# Altium schematic sheet GCM_SCH_ESP.SchDoc
size C; SheetNumber: 1; SheetTotal: 1
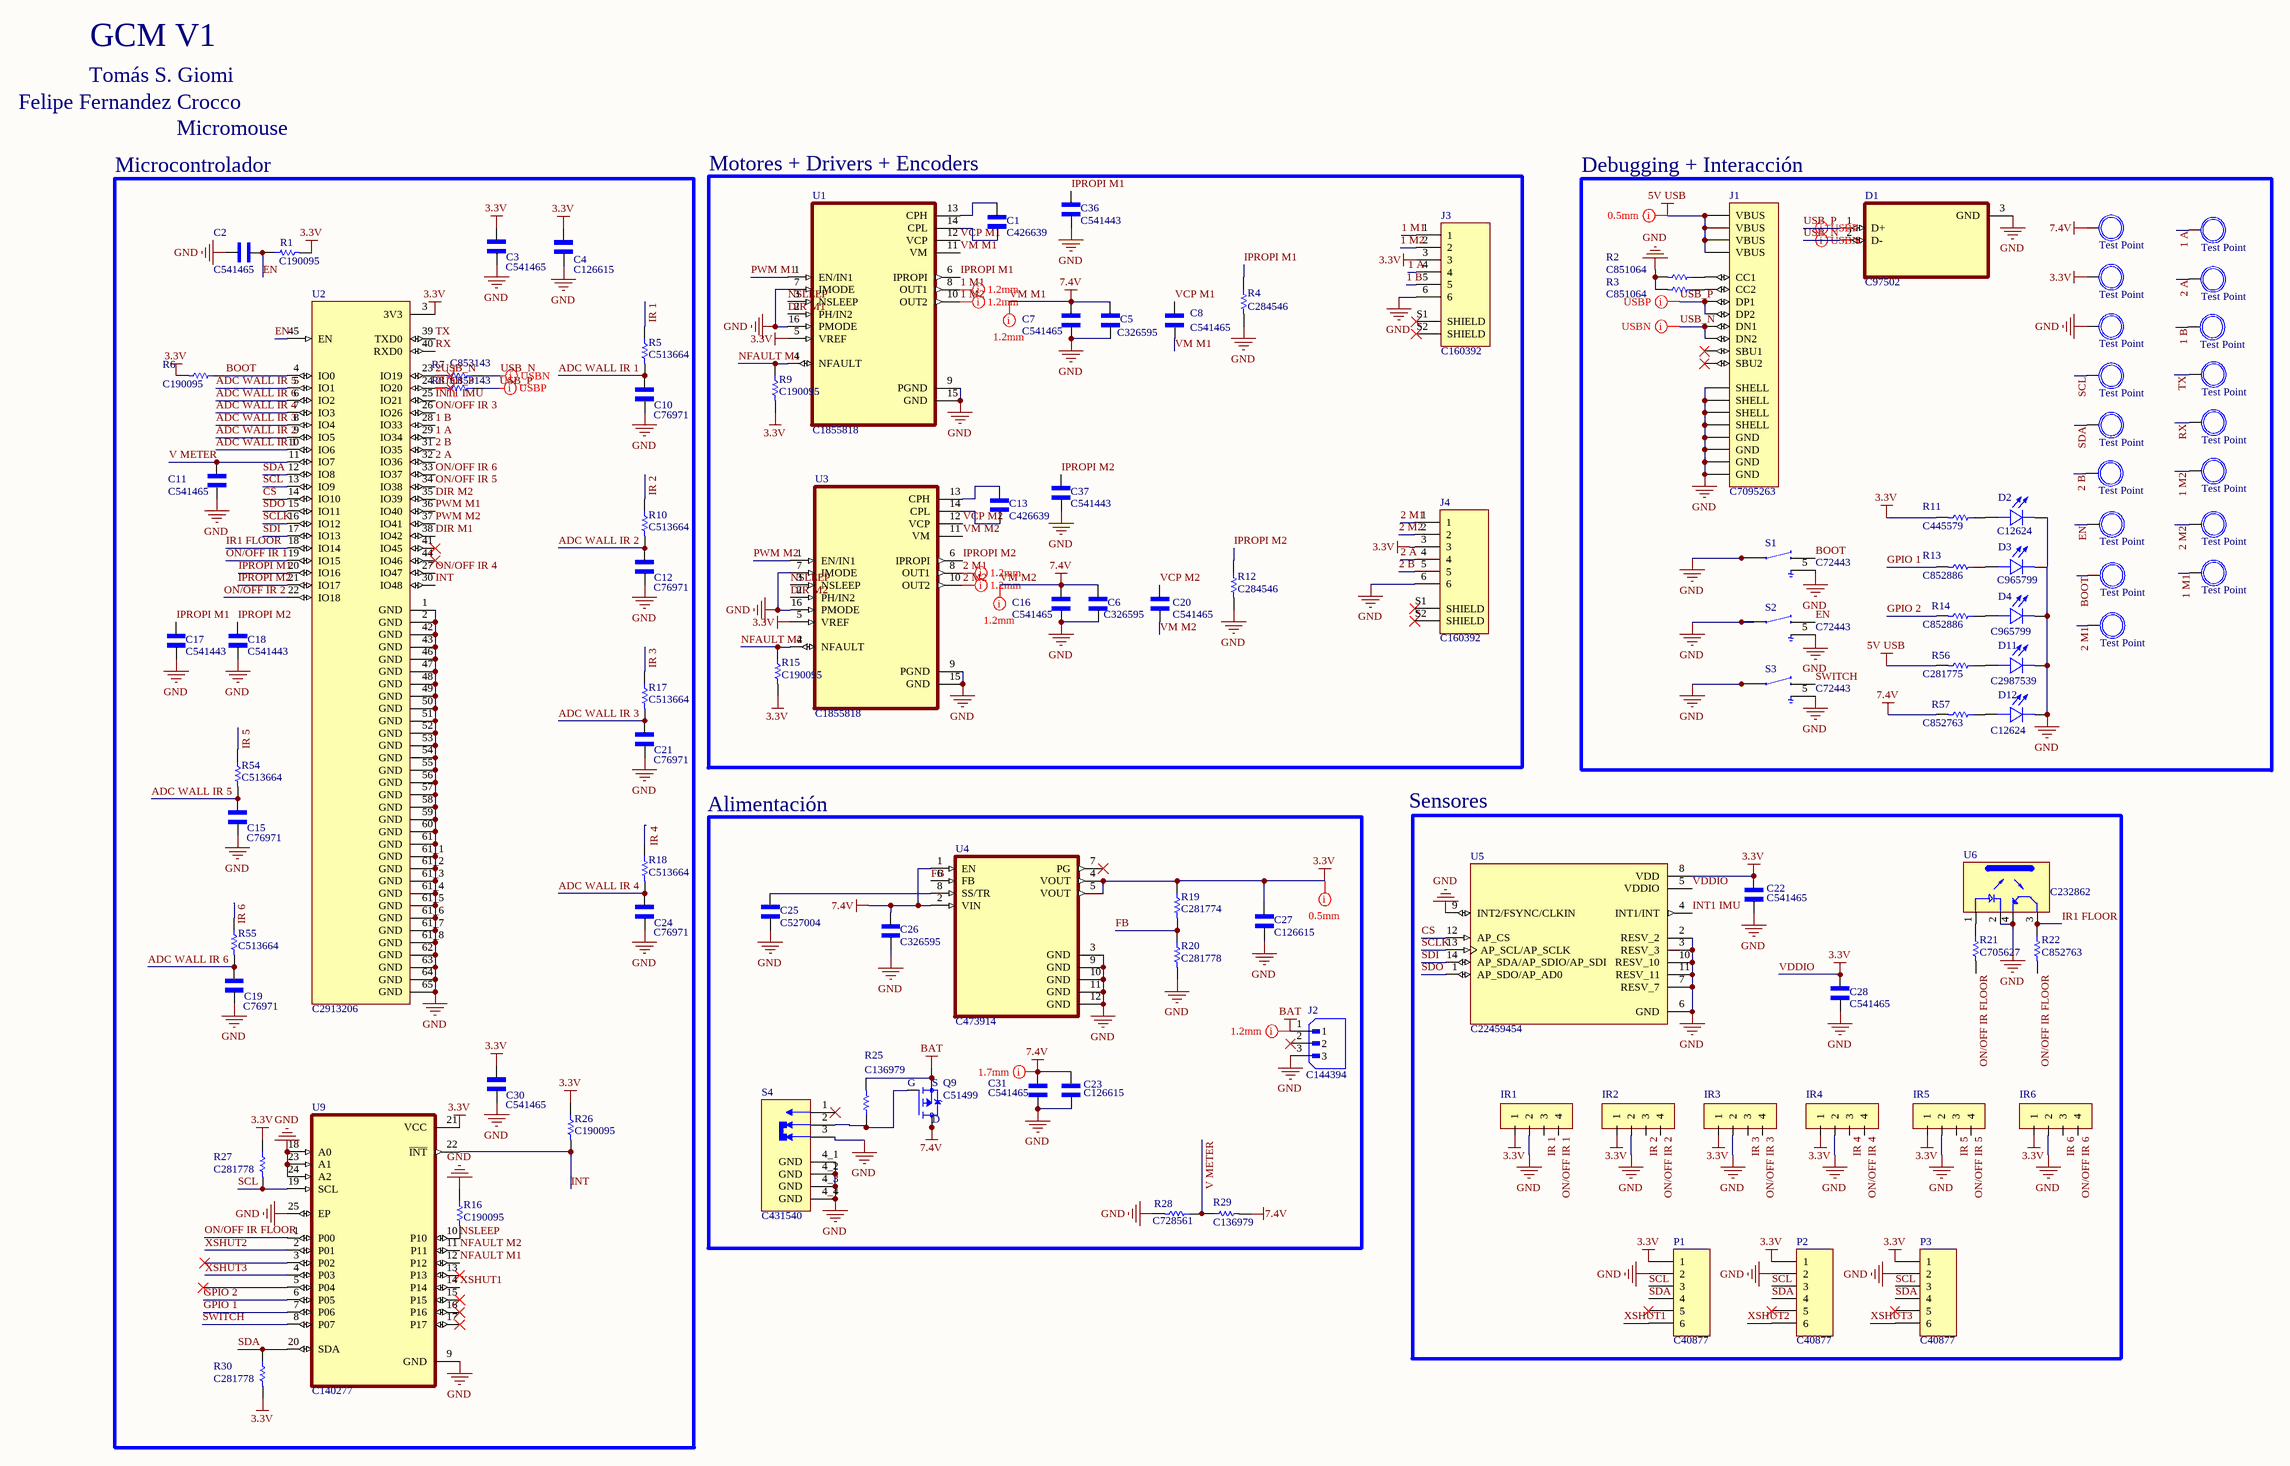
[diagram p0: GCM_SCH_ESP.SchDoc]

## Parts
(Parts that share a designator on the sheet are numbered #1, #2 ... from top to bottom, then left to right.)
?#1  Test Point  [TestPoint]  (no BOM)
?#2  Test Point  [TestPoint]  (no BOM)
?#3  Test Point  [TestPoint]  (no BOM)
?#4  Test Point  [TestPoint]  (no BOM)
?#5  Test Point  [TestPoint]  (no BOM)
?#6  Test Point  [TestPoint]  (no BOM)
?#7  Test Point  [TestPoint]  (no BOM)
?#8  Test Point  [TestPoint]  (no BOM)
?#9  Test Point  [TestPoint]  (no BOM)
?#10  Test Point  [TestPoint]  (no BOM)
?#11  Test Point  [TestPoint]  (no BOM)
?#12  Test Point  [TestPoint]  (no BOM)
?#13  Test Point  [TestPoint]  (no BOM)
?#14  Test Point  [TestPoint]  (no BOM)
?#15  Test Point  [TestPoint]  (no BOM)
?#16  Test Point  [TestPoint]  (no BOM)
?#17  Test Point  [TestPoint]  (no BOM)
C1  C426639  [CAPC1005X55N]
C2  C541465  [CAPC1005X55N]
C3  C541465  [CAPC1005X55N]
C4  C126615  [CAP_CC1210_YAG]
C5  C326595  [CAP_CC0805_YAG]
C6  C326595  [CAP_CC0805_YAG]
C7  C541465  [CAPC1005X55N]
C8  C541465  [CAPC1005X55N]
C10  C76971  [CAPC1005X55N]
C11  C541465  [CAPC1005X55N]
C12  C76971  [CAPC1005X55N]
C13  C426639  [CAPC1005X55N]
C15  C76971  [CAPC1005X55N]
C16  C541465  [CAPC1005X55N]
C17  C541443  [CAPC1005X55N]
C18  C541443  [CAPC1005X55N]
C19  C76971  [CAPC1005X55N]
C20  C541465  [CAPC1005X55N]
C21  C76971  [CAPC1005X55N]
C22  C541465  [CAPC1005X55N]
C23  C126615  [CAP_CC1210_YAG]
C24  C76971  [CAPC1005X55N]
C25  C527004  [CAPC1005X55N]
C26  C326595  [CAP_CC0805_YAG]
C27  C126615  [CAP_CC1210_YAG]
C28  C541465  [CAPC1005X55N]
C30  C541465  [CAPC1005X55N]
C31  C541465  [CAPC1005X55N]
C36  C541443  [CAPC1005X55N]
C37  C541443  [CAPC1005X55N]
D1  C97502  [SOTFL35P100X50-3N]
D2  C12624  [LED_SM0603UYC]
D3  C965799  [LED_SM0603UYC]
D4  C965799  [LED_SM0603UYC]
D11  C2987539  [LED_SM0603UYC]
D12  C12624  [LED_SM0603UYC]
IR1  IR PCB  [IR Board pins]  (value not drawn)
IR2  IR PCB  [IR Board pins]  (value not drawn)
IR3  IR PCB  [IR Board pins]  (value not drawn)
IR4  IR PCB  [IR Board pins]  (value not drawn)
IR5  IR PCB  [IR Board pins]  (value not drawn)
IR6  IR PCB  [IR Board pins]  (value not drawn)
J1  C7095263  [GCT_USB4085-GF-A_REVA4]
J2  C144394  [JST_B3B-XH-A]
J3  C160392  [JST-SH6]
J4  C160392  [JST-SH6]
P1  C40877  [FHDR1X6]
P2  C40877  [FHDR1X6]
P3  C40877  [FHDR1X6]
Q9  C51499  [SOIC127P600X175-8N]
R1  C190095  [RESC1005X35N]
R2  C851064  [RESC1005X35N]
R3  C851064  [RESC1005X35N]
R4  C284546  [RESC1005X35N]
R5  C513664  [RESC1005X35N]
R6  C190095  [RESC1005X35N]
R7  C853143  [RESC1005X35N]
R8  C853143  [RESC1005X35N]
R9  C190095  [RESC1005X35N]
R10  C513664  [RESC1005X35N]
R11  C445579  [RESC1005X35N]
R12  C284546  [RESC1005X35N]
R13  C852886  [RESC1005X35N]
R14  C852886  [RESC1005X35N]
R15  C190095  [RESC1005X35N]
R16  C190095  [RESC1005X35N]
R17  C513664  [RESC1005X35N]
R18  C513664  [RESC1005X35N]
R19  C281774  [RESC1005X35N]
R20  C281778  [RESC1005X35N]
R21  C705627  [RESC1005X35N]
R22  C852763  [RESC1005X35N]
R25  C136979  [RESC1005X35N]
R26  C190095  [RESC1005X35N]
R27  C281778  [RESC1005X35N]
R28  C728561  [RESC1005X35N]
R29  C136979  [RESC1005X35N]
R30  C281778  [RESC1005X35N]
R54  C513664  [RESC1005X35N]
R55  C513664  [RESC1005X35N]
R56  C281775  [RESC1005X35N]
R57  C852763  [RESC1005X35N]
S1  C72443  [SW_KMR221GLFS]
S2  C72443  [SW_KMR221GLFS]
S3  C72443  [SW_KMR221GLFS]
S4  C431540  [SW_MSK12C02]
U1  C1855818  [SOP65P640X120-17N]
U2  C2913206  [XCVR_ESP32-S3-MINI-1-N8]
U3  C1855818  [SOP65P640X120-17N]
U4  C473914  [CONV_TPS82140SILR]
U5  C22459454  [PQFN50P300X250X97-14N]
U6  C232862  [SOIC180P460X187-4N]
U9  C140277  [QFN50P400X400X80-25N]

## Blocks framed on the sheet
Microcontrolador: C2-C4 C10-C12 C15 C17-C19 C21 C24 C30 R1 R5-R8 R10 R16-R18 R26 R27 R30 R54 R55 U2 U9
Motores + Drivers + Encoders: C1 C5-C8 C13 C16 C20 C36 C37 J3 J4 R4 R9 R12 R15 U1 U3
Debugging + Interacción: ?#1-?#17 D1-D4 D11 D12 J1 R2 R3 R11 R13 R14 R56 R57 S1-S3
Alimentación: C23 C25-C27 C31 J2 Q9 R19 R20 R25 R28 R29 S4 U4

## Nets
5V USB: J1.A4(VBUS) J1.A9(VBUS) J1.B4(VBUS) J1.B9(VBUS) R56.2
BAT: J2.1 Q9.1(S) Q9.2(S) Q9.3(S) R25.2
GND: ?#5.1 C2.1 C3.2 C4.1 C5.1 C6.1 C7.2 C10.2 C11.2 C12.2 C15.2 C16.2 C17.2 C18.2 C19.2 C21.2 C22.2 C23.1 C24.2 C25.2 C26.1 C27.1 C28.2 C30.2 C31.2 C36.2 C37.2 D1.3(GND) D2.C D3.C D4.C D11.C D12.C IR1.2 IR2.2 IR3.2 IR4.2 IR5.2 IR6.2 J1.A1(GND) J1.A12(GND) J1.B1(GND) J1.B12(GND) J1.S1(SHELL) J1.S2(SHELL) J1.S3(SHELL) J1.S4(SHELL) J2.3 J3.6 J4.6 P1.2 P2.2 P3.2 R2.2 R3.2 R4.2 R12.2 R16.1 R20.2 R28.2 S1.1 S1.4 S1.5 S2.1 S2.4 S2.5 S3.1 S3.4 S3.5 S4.3 S4.4_1(GND) S4.4_2(GND) S4.4_3(GND) S4.4_4(GND) U1.7(IMODE) U1.9(PGND) U1.15(GND) U1.16(PMODE) U2.1(GND) U2.2(GND) U2.42(GND) U2.43(GND) U2.46(GND) U2.47(GND) U2.48(GND) U2.49(GND) U2.50(GND) U2.51(GND) U2.52(GND) U2.53(GND) U2.54(GND) U2.55(GND) U2.56(GND) U2.57(GND) U2.58(GND) U2.59(GND) U2.60(GND) U2.61(GND) U2.61_1(GND) U2.61_2(GND) U2.61_3(GND) U2.61_4(GND) U2.61_5(GND) U2.61_6(GND) U2.61_7(GND) U2.61_8(GND) U2.62(GND) U2.63(GND) U2.64(GND) U2.65(GND) U3.7(IMODE) U3.9(PGND) U3.15(GND) U3.16(PMODE) U4.3(GND) U4.9(GND) U4.10(GND) U4.11(GND) U4.12(GND) U5.2(RESV_2) U5.3(RESV_3) U5.6(GND) U5.7(RESV_7) U5.9(INT2/FSYNC/CLKIN) U5.10(RESV_10) U5.11(RESV_11) U6.2(C) U6.4(ET) U9.9(GND) U9.18(A0) U9.23(A1) U9.24(A2) U9.25(EP)
VDDIO: ?#3.1 C3.1 C4.2 C22.1 C27.2 C28.1 C30.1 IR1.1 IR2.1 IR3.1 IR4.1 IR5.1 IR6.1 J3.3 J4.3 P1.1 P2.1 P3.1 R1.2 R6.2 R9.2 R11.2 R15.2 R19.1 R26.1 R27.1 R30.2 U1.5(VREF) U2.3(3V3) U3.5(VREF) U4.4(VOUT) U4.5(VOUT) U5.5(VDDIO) U5.8(VDD) U9.21(VCC)  [also labelled 3.3V]
VM M1: ?#1.1 C5.2 C6.2 C7.1 C8.2 C16.1 C20.2 C23.2 C26.2 C31.1 Q9.5(D) Q9.6(D) Q9.7(D) R29.2 R57.2 U1.11(VM) U3.11(VM) U4.1(EN) U4.2(VIN)  [also labelled 7.4V, VM M2]
1 A: ?#2.1 J3.4 U2.29(IO34)
1 B: ?#6.1 J3.5 U2.28(IO33)
1 M1: ?#16.1 J3.1 U1.8(OUT1)
1 M2: ?#11.1 J3.2 U1.10(OUT2)
2 A: ?#4.1 J4.4 U2.32(IO36)
2 B: ?#12.1 J4.5 U2.31(IO35)
2 M1: ?#17.1 J4.1 U3.8(OUT1)
2 M2: ?#14.1 J4.2 U3.10(OUT2)
2USB_N: R7.2 U2.23(IO19)
2USB_P: R8.2 U2.24(IO20)
ADC WALL IR 1: C10.1 R5.2 U2.10(IO6)
ADC WALL IR 2: C12.1 R10.2 U2.9(IO5)
ADC WALL IR 3: C21.1 R17.2 U2.8(IO4)
ADC WALL IR 4: C24.1 R18.2 U2.7(IO3)
ADC WALL IR 5: C15.1 R54.2 U2.5(IO1)
ADC WALL IR 6: C19.1 R55.2 U2.6(IO2)
BOOT: ?#15.1 R6.1 S1.2 S1.3 U2.4(IO0)
CS: U2.14(IO10) U5.12(AP_CS)
DIR M1: U1.2(PH/IN2) U2.38(IO42)
DIR M2: U2.35(IO39) U3.2(PH/IN2)
EN: ?#13.1 C2.2 R1.1 S2.2 S2.3 U2.45(EN)
FB: R19.2 R20.1 U4.6(FB)
GPIO 1: R13.2 U9.7(P06)
GPIO 2: R14.2 U9.6(P05)
INT: R26.2 U2.30(IO48) U9.22(~{INT})
INT1 IMU: U2.25(IO21) U5.4(INT1/INT)
IPROPI M1: C17.1 C36.1 R4.1 U1.6(IPROPI) U2.20(IO16)
IPROPI M2: C18.1 C37.1 R12.1 U2.21(IO17) U3.6(IPROPI)
IR1 FLOOR: R22.1 U2.18(IO14) U6.3(CT)
IR 1: IR1.3 R5.1
IR 2: IR2.3 R10.1
IR 3: IR3.3 R17.1
IR 4: IR4.3 R18.1
IR 5: IR5.3 R54.1
IR 6: IR6.3 R55.1
NFAULT M1: R9.1 U1.4(NFAULT) U9.12(P12)
NFAULT M2: R15.1 U3.4(NFAULT) U9.11(P11)
NSLEEP: R16.2 U1.3(NSLEEP) U3.3(NSLEEP) U9.10(P10)
ON/OFF IR 1: IR1.4 U2.19(IO15)
ON/OFF IR 2: IR2.4 U2.22(IO18)
ON/OFF IR 3: IR3.4 U2.26(IO26)
ON/OFF IR 4: IR4.4 U2.27(IO47)
ON/OFF IR 5: IR5.4 U2.34(IO38)
ON/OFF IR 6: IR6.4 U2.33(IO37)
ON/OFF IR FLOOR: R21.2 R22.2 U9.1(P00)
PWM M1: U1.1(EN/IN1) U2.36(IO40)
PWM M2: U2.37(IO41) U3.1(EN/IN1)
RX: ?#10.1 U2.40(RXD0)
SCL: ?#7.1 P1.3 P2.3 P3.3 R27.2 U2.13(IO9) U9.19(SCL)
SCLK: U2.16(IO12) U5.13(AP_SCL/AP_SCLK)
SDA: ?#9.1 P1.4 P2.4 P3.4 R30.1 U2.12(IO8) U9.20(SDA)
SDI: U2.17(IO13) U5.14(AP_SDA/AP_SDIO/AP_SDI)
SDO: U2.15(IO11) U5.1(AP_SDO/AP_AD0)
SWITCH: S3.2 S3.3 U9.8(P07)
TX: ?#8.1 U2.39(TXD0)
USB_N: D1.2(D-) J1.A7(DN1) J1.B7(DN2) R7.1
USB_P: D1.1(D+) J1.A6(DP1) J1.B6(DP2) R8.1
V METER: C11.1 R28.1 R29.1 U2.11(IO7)
VCP M1: C8.1 U1.12(VCP)
VCP M2: C20.1 U3.12(VCP)
XSHUT1: P1.6 U9.14(P14)
XSHUT2: P2.6 U9.2(P01)
XSHUT3: P3.6 U9.4(P03)
NetC1_1: C1.1 U1.13(CPH)
NetC1_2: C1.2 U1.14(CPL)
NetC13_1: C13.1 U3.13(CPH)
NetC13_2: C13.2 U3.14(CPL)
NetC25_1: C25.1 U4.8(SS/TR)
NetD2_A: D2.A R11.1
NetD3_A: D3.A R13.1
NetD4_A: D4.A R14.1
NetD11_A: D11.A R56.1
NetD12_A: D12.A R57.1
NetJ1_A5: J1.A5(CC1) R2.1
NetJ1_B5: J1.B5(CC2) R3.1
NetQ9_4: Q9.4(G) R25.1 S4.2
NetR21_1: R21.1 U6.1(A)

Not connected (* = marked no-connect by the designer): J1 A8(SBU1)* B8(SBU2)*; J2 2*; J3 S1(SHIELD)* S2(SHIELD)*; J4 S1(SHIELD)* S2(SHIELD)*; P1 5*; P2 5*; P3 5*; Q9 8(D); S4 1*; U2 41(IO45)* 44(IO46)*; U4 7(PG)*; U9 3(P02)* 5(P04)* 13(P13)* 15(P15)* 16(P16)* 17(P17)*

## Layout directives
differential pair: 2USB_N, 2USB_P, USB_N, USB_P
net class 1.2mm: 1 M1, 1 M2, 2 M1, 2 M2, BAT, VM M1
net class 0.5mm: VDDIO
mark named 0.5mm: 5V USB

## Notes on the sheet
- Tomás S. Giomi
- GCM V1
- Felipe Fernandez Crocco
- Micromouse
- Sensores

## Library data of the parts
C1-C3 C7 C8 C10-C13 C15-C22 C24 C25 C28 C30 C31 C36 C37 = CC0402JRX7R8BB103: 10000 pF Â±5% 25V Ceramic Capacitor X7R 0402 (1005 Metric); MF: Yageo; Value: *; MP: CC0402JRX7R8BB103; Package: 0402 Yageo; SnapEDA_Link: https://www.snapeda.com/parts/CC0402JRX7R8BB103/Yageo/view-part/?ref=snap; Check_prices: https://www.snapeda.com/parts/CC0402JRX7R8BB103/Yageo/view-part/?ref=eda
C4 C23 C27 = CC1210KKX7R7BB226: Description; Manufacturer_Name: Yageo; Copyright: Copyright (C) 2026 Ultra Librarian. All rights reserved.; Manufacturer_Part_Number: CC1210KKX7R7BB226
C5 C6 C26 = CC0805KKX7R7BB106: Description; Manufacturer_Name: Yageo; Copyright: Copyright (C) 2026 Ultra Librarian. All rights reserved.; Manufacturer_Part_Number: CC0805KKX7R7BB106
D1 = TPD2EUSB30DRTR: 2-channel ESD solution for SuperSpeed USB 3.0 interface 3-SOT-9X3 -40 to 85; MF: Texas Instruments; Package: SOT-9X3-3 Texas Instruments; Purchase-URL: https://pricing.snapeda.com/search/part/TPD2EUSB30DRTR/?ref=eda; Value: *; MP: TPD2EUSB30DRTR; Availability: Warning; SnapEDA_Link: https://www.snapeda.com/parts/TPD2EUSB30DRTR/Texas%20Instruments/view-part/189118/?ref=snap; Price: None
D2-D4 D11 D12 = SM0603UYC: LED SMD 0603 Ultra Yellow 593nm 70mcd Water Clear Lens 130 Deg Viewing Angle | Bivar Inc. SM0603UYC; SnapEDA_Link: https://www.snapeda.com/parts/SM0603UYC/Bivar/view-part/?ref=snap; Package: 0603 Bivar; Value: *; MF: Bivar; MP: SM0603UYC; Check_prices: https://www.snapeda.com/parts/SM0603UYC/Bivar/view-part/?ref=eda
J1 = USB4085-GF-A_REVA4: USB-C (USB TYPE-C) USB 2.0 Receptacle Connector 24 (16+8 Dummy) Position Through Hole, Right Angle, low cost, 3.46mm profile, 16 pin, horizontal, Top mount; MF: Global Connector Technology; SnapEDA_Link: https://www.snapeda.com/parts/USB4085-GF-A/Global+Connector+Technology/view-part/?ref=snap; Package: None; MP: USB4085-GF-A; Check_prices: https://www.snapeda.com/parts/USB4085-GF-A/Global+Connector+Technology/view-part/?ref=eda; Purchase-URL: https://pricing.snapeda.com/search/part/USB4085-GF-A/?ref=eda; Price: None; Value: *; Availability: In Stock
J2 = B3B-XH-A: Connector Header Through Hole 3 position 0.098 (2.50mm); MF: JST Sales; SnapEDA_Link: https://www.snapeda.com/parts/B3B-XH-A/JST/view-part/?ref=snap; Package: None; Value: *; MP: B3B-XH-A; Check_prices: https://www.snapeda.com/parts/B3B-XH-A/JST/view-part/?ref=eda
J3 J4 = JST-SH6: MP: BM06B-SRSS-TB(LF)(SN); Package: None; Price: None; Value: *; Availability: Unavailable
P1-P3 = FHeader 6X1: LatestRevisionDate: 17-Jul-2002; LatestRevisionNote: Re-released for DXP Platform.; Publisher: Altium Limited
Q9 = AO4485: P-Channel 40 V 10A (Ta) 1.7W (Ta) Surface Mount 8-SOIC; MF: Alpha &; SnapEDA_Link: https://www.snapeda.com/parts/AO4485/Alpha/view-part/?ref=snap; Package: SOIC-8 Alpha &amp; Omega Semiconductor; Value: *; MP: AO4485; Check_prices: https://www.snapeda.com/parts/AO4485/Alpha/view-part/?ref=eda
R1-R22 R25-R30 R54-R57 = RT0402FRE0724KL: RT Series 0402 0.063 W 24 kOhm Â±1 % Â±50 ppm/Â°C SMT Thin Film Chip Resistor; MF: Yageo; Value: *; SnapEDA_Link: https://www.snapeda.com/parts/RT0402FRE0724KL/Yageo/view-part/?ref=snap; Package: 1005 Yageo; MP: RT0402FRE0724KL; Check_prices: https://www.snapeda.com/parts/RT0402FRE0724KL/Yageo/view-part/?ref=eda
S1-S3 = KMR221GLFS: Switch Tactile N.O. SPST Button Gull Wing 0.05A 32VDC 1VA 200000Cycles 2N SMD Automotive T/R; MF: CK; SnapEDA_Link: https://www.snapeda.com/parts/KMR221G%20LFS/C%2526K/view-part/?ref=snap; Package: None; Value: *; MP: KMR221G LFS; Check_prices: https://www.snapeda.com/parts/KMR221G%20LFS/C%2526K/view-part/?ref=eda
S4 = MSK12C02: Package: None; Price: None; Value: *; MP: MSK12C02; Availability: Unavailable
U1 U3 = DRV8874PWPR: 40-V, 6-A H-bridge motor driver with integrated current sensing feedback; MF: Texas Instruments; SnapEDA_Link: https://www.snapeda.com/parts/DRV8874PWPR/Texas+Instruments/view-part/?ref=snap; Package: HTSSOP-16 Texas Instruments; Value: *; MP: DRV8874PWPR; Check_prices: https://www.snapeda.com/parts/DRV8874PWPR/Texas+Instruments/view-part/?ref=eda
U2 = ESP32-S3-MINI-1-N8: MF: {'manufacturer': u'Espressif Systems'}; Package: None; Price: None; Value: *; MP: ESP32-S3-MINI-1-N8; Availability: Unavailable
U4 = TPS82130SILT: Non-Isolated PoL Module DC DC Converter 1 Output 0.9 ~ 5V - - - 3A 3V - 17V Input; MF: Texas Instruments; SnapEDA_Link: https://www.snapeda.com/parts/TPS82130SIL/Texas+Instruments/view-part/?ref=snap; Package: None; Value: *; MP: TPS82130SIL; Check_prices: https://www.snapeda.com/parts/TPS82130SIL/Texas+Instruments/view-part/?ref=eda
U5 = ICM-45686: Accelerometer, Gyroscope, 6 Axis Sensor Output; MP: ICM-42688-P; Package: None; Value: *; Availability: Unavailable; Price: None
U6 = QRE1113GR: Reflective Optical Sensor 0.039 (1mm) 4-SMD, Gull Wing; MF: ON Semiconductor; Package: ARUSM-313-4 ON Semiconductor; Price: None; Check_prices: https://www.snapeda.com/parts/QRE1113GR/Onsemi/view-part/?ref=eda; Value: *; SnapEDA_Link: https://www.snapeda.com/parts/QRE1113GR/Onsemi/view-part/?ref=snap; MP: QRE1113GR; Availability: In Stock; Purchase-URL: https://pricing.snapeda.com/search/part/QRE1113GR/?ref=eda
U9 = TCA9555RTWR: Package: None; Price: None; Value: *; MP: TCA9555RTWR; Availability: Unavailable